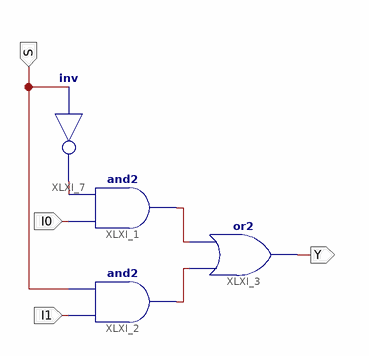
[diagram p0: schematic sheet 1]
// Xilinx ISE schematic mux_2to1.sch (virtex6) as structural Verilog: 4 symbols, 4 ports
module mux_2to1 (
  input  I0,
  input  I1,
  input  S,
  output Y
);

  wire XLXN_1, XLXN_2, XLXN_22;

  and XLXI_1 (XLXN_1, I0, XLXN_22);
  and XLXI_2 (XLXN_2, I1, S);
  or XLXI_3 (Y, XLXN_2, XLXN_1);
  not XLXI_7 (XLXN_22, S);
endmodule
